# Altium schematic sheet mic.SchDoc
size A
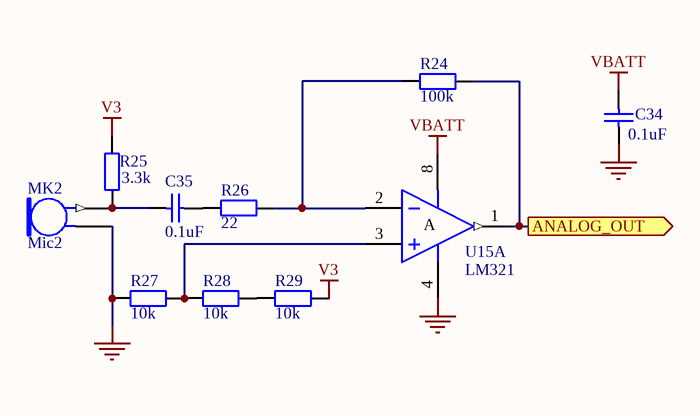
[diagram p0: mic.SchDoc]

## Parts
C34  0.1uF  [CAPC2012L]
C35  0.1uF  [CAPC1608L]
MK2  Mic2  [electret_6mm]
R24  100k  [RESC1608L]
R25  3.3k  [RESC1608L]
R26  22  [RESC1608L]
R27  10k  [RESC1608L]
R28  10k  [RESC1608L]
R29  10k  [RESC1608L]
U15  LM321  (part A of 2)

## Ports
ANALOG_OUT (out)

## Nets
GND: C34.2 MK2.2 R27.1 U15.4(V-)
V3: R25.1 R29.2
VBATT: C34.1 U15.8(V+)
ANALOG_OUT: R24.2 U15.1(OUT) ; port ANALOG_OUT
NetC35_1: C35.1 R26.1
NetC35_2: C35.2 MK2.1 R25.2
NetR24_1: R24.1 R26.2 U15.2(IN-)
NetR27_2: R27.2 R28.1 U15.3(IN+)
NetR28_2: R28.2 R29.1

## Notes on the sheet
- (in symbol LM358D, part A) A

## Library data of the parts
C34 C35 = Cap: Capacitor; Published: 8-Jun-2000; LatestRevisionDate: 17-Jul-2002; LatestRevisionNote: Re-released for DXP Platform.; PackageReference: RAD-0.3; Publisher: Altium Limited; PackageDescription: Radial Cap, Thru-Hole; 2 Leads; 0.3 in Pin Spacing; Value: 0.1uF
MK2 = Mic2: Microphone; Published: *; LatestRevisionDate: *; LatestRevisionNote: *; PackageReference: *; Publisher: *
R24-R29 = Res2: Resistor; Published: 8-Jun-2000; LatestRevisionDate: 17-Jul-2002; LatestRevisionNote: Re-released for DXP Platform.; PackageReference: AXIAL-0.4; Publisher: Altium Limited
  R24: Value: 100k
  R25: Value: 3.3k
  R26: Value: 22
  R27-R29: Value: 10k
U15 = LM358D: Dual Operational Amplifier; Published: 16-Jan-2001; LatestRevisionDate: 13-Apr-2006; LatestRevisionNote: IPC-7351 Footprint Added.; DatasheetVersion: Jul-1998; PackageVersion: Jan-1998; PackageReference: D008; Publisher: Altium Limited; PackageDescription: 8-Pin Small Outline Integrated Circuit 1.27 mm Pitch; Code_IPC: SOIC127P600-8; ComponentLink1Description: Manufacturer Link; ComponentLink1URL: http://www.ti.com/; ComponentLink2Description: Datasheet; ComponentLink2URL: http://www-s.ti.com/sc/ds/lm358.pdf